# EAGLE design NE555TEST (EAGLE 9.6.2)
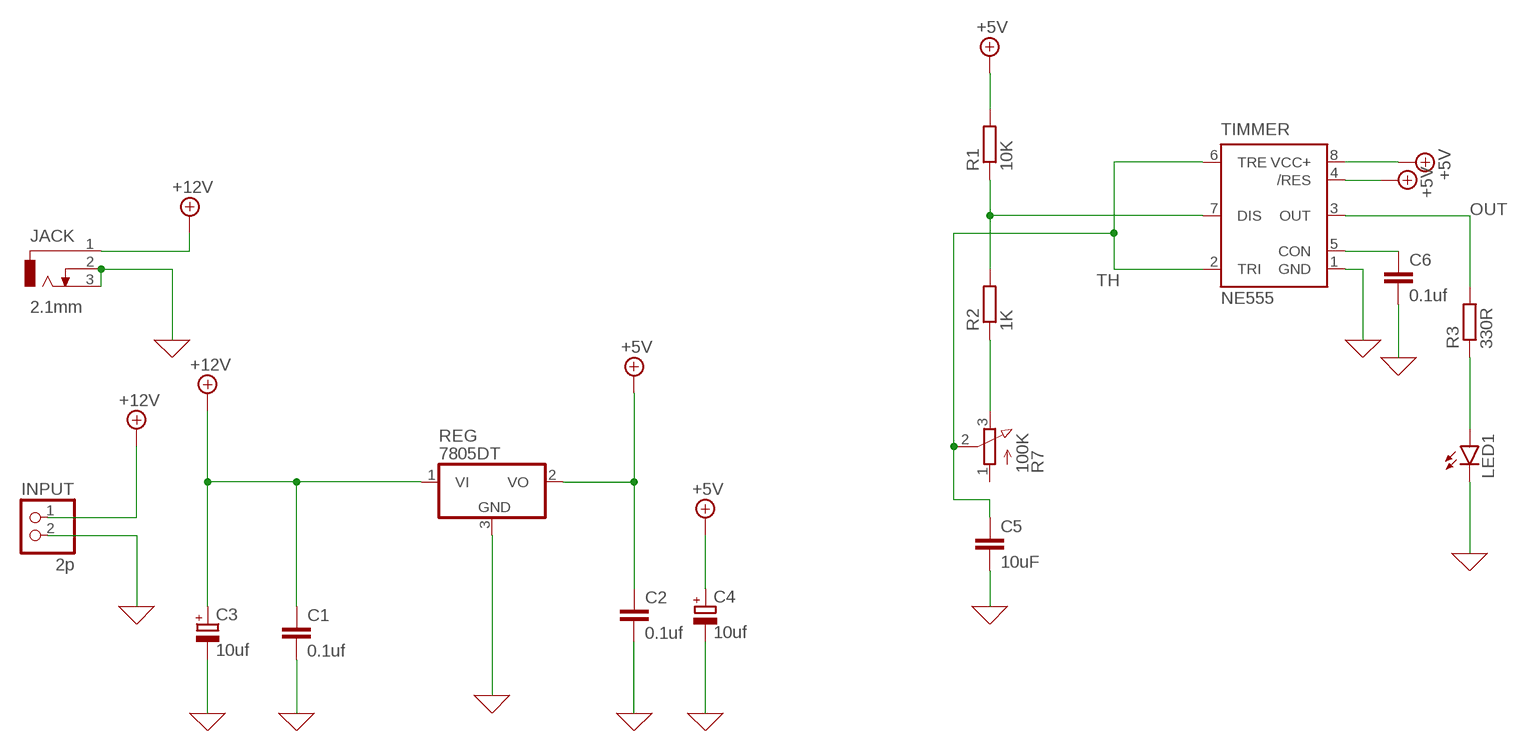
[diagram p0: schematic, sheet 1]

## Parts
C1  0.1uf  C-EU050-030X075  [C050-030X075]
C2  0.1uf  C-EU050-030X075  [C050-030X075]
C3  10uf  CPOL-EUE3.5-8  [E3,5-8]
C4  10uf  CPOL-EUE3.5-8  [E3,5-8]
C5  10uF  C-EU050-030X075  [C050-030X075]
C6  0.1uf  C-EU050-030X075  [C050-030X075]
INPUT  2p  PINHD-1X2  [1X02]
JACK  2.1mm  DCJ0202  [DCJ0202]
LED1  LED3MM  [LED3MM]
R1  10K  R-EU_0207/10  [0207/10]
R2  1K  R-EU_0207/10  [0207/10]
R3  330R  R-EU_0207/10  [0207/10]
R7  100K  3RP/1610N  [3RP/1610N]
REG  7805DT  [TO252]
TIMMER  NE555  [DIL-08]

## Nets
0 [power]: C1.2 C2.2 C3.- C4.- C5.2 C6.2 INPUT.2 JACK.2 JACK.3 LED1.K(C) REG.3(GND) TIMMER.1(GND) ; supply symbol labelled GND
+5V [power]: C2.1 C4.+ R1.2 REG.2(VO) TIMMER.4(/RES) TIMMER.8(VCC+)
+12V [power]: C1.1 C3.+ INPUT.1 JACK.1 REG.1(VI)
N$1: C6.1 TIMMER.5(CON)
N$2: R1.1 R2.2 TIMMER.7(DIS)
N$3: R2.1 R7.3(E)
N$6: LED1.A R3.1
OUT: R3.2 TIMMER.3(OUT)
TH: C5.1 R7.2(S) TIMMER.2(TRI) TIMMER.6(TRE)
Unconnected: R7.1(A)

## Library data of the parts
C1 C2 C5 C6 = rcl:C-EU: CAPACITOR, European symbol; SPICEPREFIX: C
C3 C4 = rcl:CPOL-EU: POLARIZED CAPACITOR, European symbol; SPICEPREFIX: C
INPUT = pinhead:PINHD-1X2: PIN HEADER
JACK = con-jack:DCJ0202: DC POWER JACK Source: DCJ0202.pdf; OC_FARNELL: unknown; OC_NEWARK: unknown
LED1 = led:LED: LED OSRAM: - CHIPLED LG R971, LG N971, LY N971, LG Q971, LY Q971, LO R971, LY R971 LH N974, LH R974 LS Q976, LO Q976, LY Q976 LO Q996 - Hyper CHIPLED LW Q18S LB Q993, LB Q99A, LB R99A - SideLED LS A670, LO A670, LY A670, LG A670, LP A670 LB A673, LV A673, LT A673, LW A673 LH A674 LY A675 LS A676, LA A676, LO A676, LY A676, LW A676 LS A679, LY A679, LG A679 - Hyper Micro SIDELED® LS Y876, LA Y876, LO Y876, LY Y876 LT Y87S - SmartLED LW L88C, LW L88S LB L89C, LB L89S, LG L890 LS L89K, LO L89K, LY L89K LS L896, LA L896, LO L896, LY L896 - TOPLED LS T670, LO T670, LY T670, LG T670, LP T670 LSG T670, LSP T670, LSY T670, LOP T670, LYG T670 LG T671, LOG T671, LSG T671 LB T673, LV T673, LT T673, LW T673 LH T674 LS T676, LA T676, LO T676, LY T676, LB T676, LH T676, LSB T676, LW T676 LB T67C, LV T67C, LT T67C, LS T67K, LO T67K, LY T67K, LW E67C LS E67B, LA E67B, LO E67B, LY E67B, LB E67C, LV E67C, LT E67C LW T67C LS T679, LY T679, LG T679 LS T770, LO T770, LY T770, LG T770, LP T770 LB T773, LV T773, LT T773, LW T773 LH T774 LS E675, LA E675, LY E675, LS T675 LS T776, LA T776, LO T776, LY T776, LB T776 LHGB T686 LT T68C, LB T68C - Hyper Mini TOPLED® LB M676 - Mini TOPLED Santana® LG M470 LS M47K, LO M47K, LY M47K Source: http://www.osram.convergy.de LUXEON: - LUMILED® LXK2-PW12-R00, LXK2-PW12-S00, LXK2-PW14-U00, LXK2-PW14-V00 LXK2-PM12-R00, LXK2-PM12-S00, LXK2-PM14-U00 LXK2-PE12-Q00, LXK2-PE12-R00, LXK2-PE12-S00, LXK2-PE14-T00, LXK2-PE14-U00 LXK2-PB12-K00, LXK2-PB12-L00, LXK2-PB12-M00, LXK2-PB14-N00, LXK2-PB14-P00, LXK2-PB14-Q00 LXK2-PR12-L00, LXK2-PR12-M00, LXK2-PR14-Q00, LXK2-PR14-R00 LXK2-PD12-Q00, LXK2-PD12-R00, LXK2-PD12-S00 LXK2-PH12-R00, LXK2-PH12-S00 LXK2-PL12-P00, LXK2-PL12-Q00, LXK2-PL12-R00 Source: www.luxeon.com KINGBRIGHT: KA-3528ASYC Source: www.kingbright.com
R1-R3 = rcl:R-EU_: RESISTOR, European symbol; SPICEPREFIX: R
R7 = pot:3RP/1610N: 16mm Potentiometer one level Source: http://www.alphapotentiometers.net/html/16mm_pot_2.html
REG = linear:78*: Positive VOLTAGE REGULATOR Source: http://cache.national.com/ds/LM/LM78L05.pdf http://www.fairchildsemi.com/ds/LM/LM7805.pdf
TIMMER = st-microelectronics:NE555: General purpose bipolar Timer; MF: Arrow Electronics; MPN: NE555N; OC_FARNELL: 1467742; OC_NEWARK: 89K1486

## Net classes
0 default: width 0.305 mm, drill 0.305 mm, clearance 0.254 mm
1 power: width 0.406 mm, drill 0.406 mm, clearance 0.305 mm

## Board
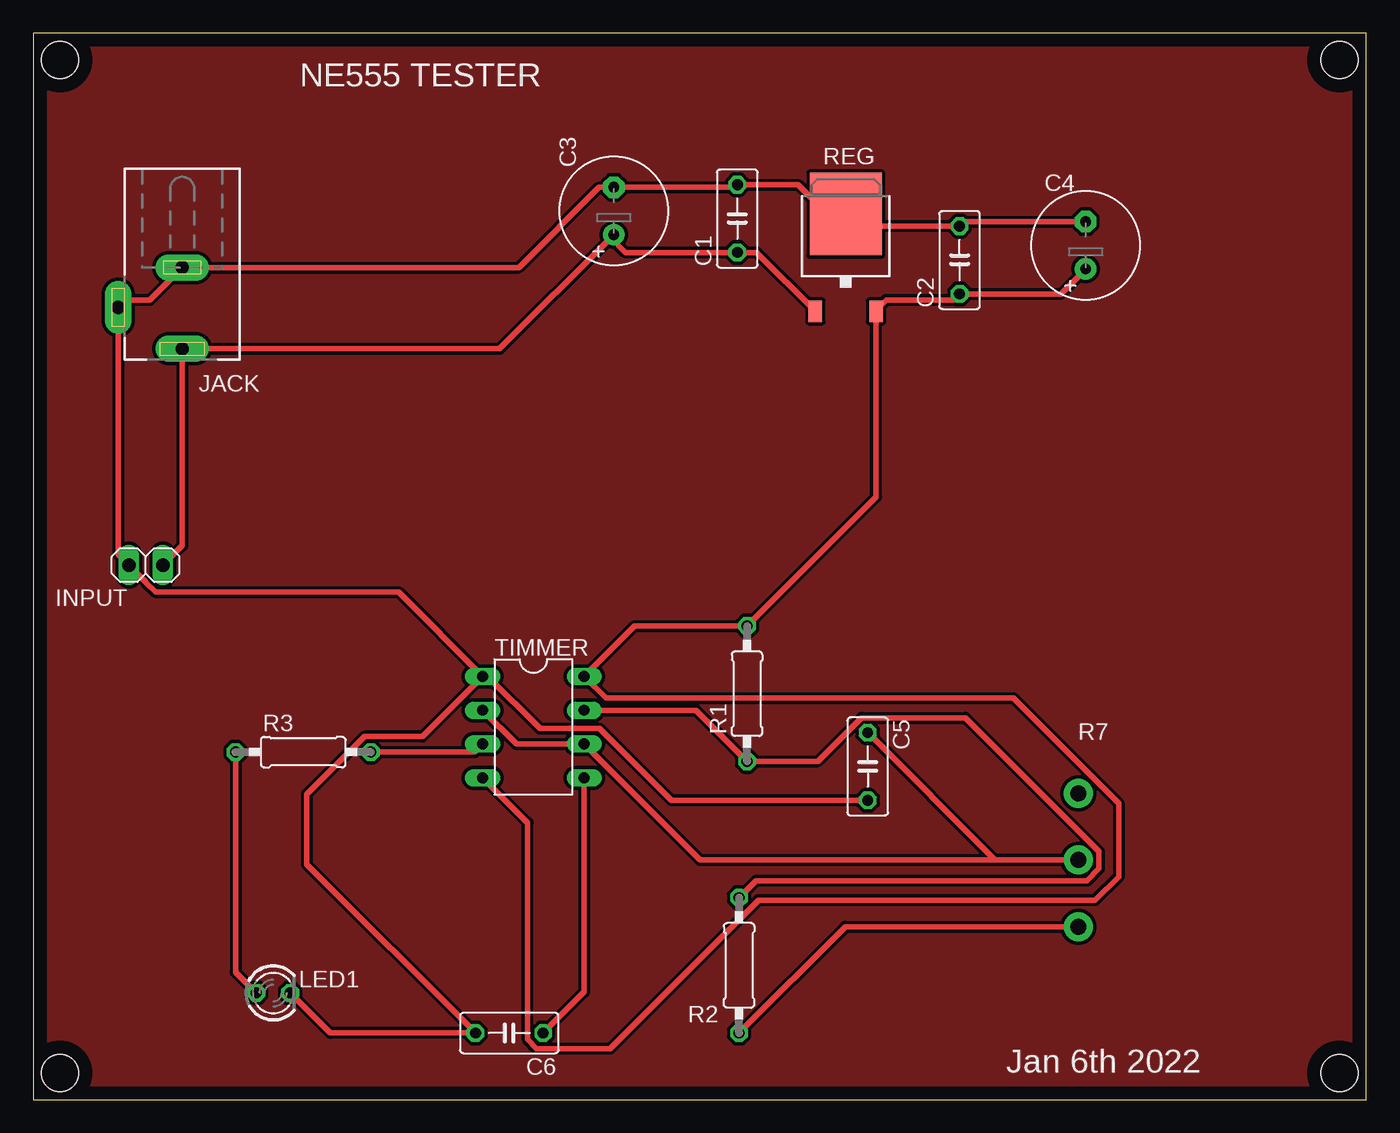
[diagram p1: board, top side]
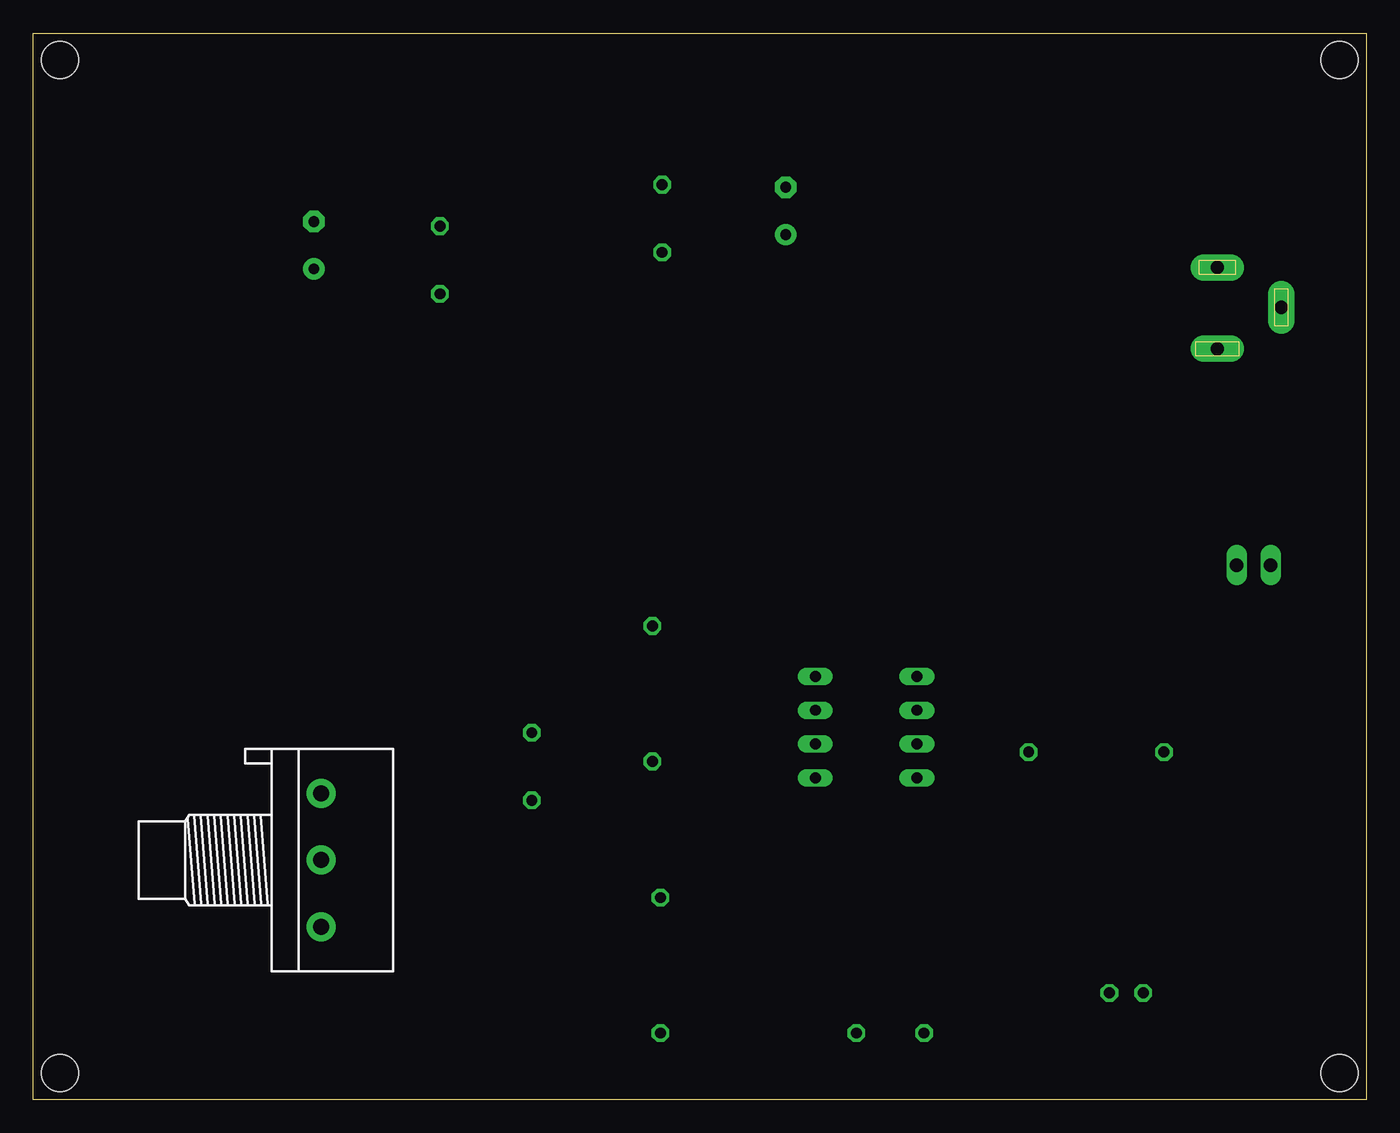
[diagram p2: board, bottom side, seen from below]

Size 100 x 80 mm. Coordinates in mm from the lower left corner, seen from the top.
Outline: 0,0 100,0 100,80 0,80 0,0
Copper layers (1*16): Top 0.035mm / dielectric 1.5mm / Bottom 0.035mm
Design rules "default": minimum track width 6mil, minimum drill 0.35mm, track to track 6mil, track to pad 6mil, pad to pad 6mil, via to via 6mil, smd to smd 6mil, copper to edge 40mil, drill to drill 6mil, minimum pad ring 10mil, minimum via ring 8mil, stop-mask expansion 4mil, vias tented up to drill 0mil, thermal gap 10mil
Holes 2.8 mm at 2,78 98,78 2,2 98,2

### Footprints (pad centres in the part's own frame; a part is rotated, then mirrored left to right if it is on the bottom)
C050-030X075 = drill 0.813 octagon: 1 -2.54,0; 2 2.54,0
E3,5-8 = drill 0.813 pad 1.6: + -1.778,0 | drill 0.813 pad 1.6 octagon: - 1.778,0
1X02 = drill 1.016 long: 1 -1.27,0; 2 1.27,0
DCJ0202 = drill 1 pad 2 long: 1 0,3.1; 2 4.8,0; 3 0,-3
LED3MM = drill 0.813 octagon: A -1.27,0; K 1.27,0
0207/10 = drill 0.813 octagon: 1 -5.08,0; 2 5.08,0
3RP/1610N = drill 1.2 pad 2.184: 1 -5,0; 2 0,0; 3 5,0
TO252 = smd 1 x 1.6: 1 -2.28,-4.8; 2 2.28,-4.8 | smd 5.4 x 6.2: 3 0,2.5
DIL-08 = drill 0.813 long: 1 -3.81,-3.81; 2 -1.27,-3.81; 3 1.27,-3.81; 4 3.81,-3.81; 5 3.81,3.81; 6 1.27,3.81; 7 -1.27,3.81; 8 -3.81,3.81

### Placement (x,y rotation side)
C1  52.82,66.1 90 top
C2  69.49,62.99 90 top
C3  43.55,66.67 90 top
C4  78.95,64.1 90 top
C5  62.6,24.99 270 top
C6  35.71,4.99 180 top
INPUT  8.44,40.1 180 top
JACK  11.17,59.43 180 top
LED1  18,8 0 top
R1  53.55,30.45 90 top
R2  52.95,10.07 90 top
R3  20.25,26.07 0 top
R7  78.41,17.97 270 bottom
REG  60.95,63.94 0 top
TIMMER  37.52,27.94 270 top

### Tracks (layer width: path | path; a pad name or v marks a point on that pad's centre or on a via)
0
  Top 0.406: 61,66.49 61,67 60,66 57.36,68.64 C1.2 52.63,68.45 C3.- 42.45,68.45 36.43,62.43 JACK.3 8.74,60 6,60 6,59.8 JACK.2 6.37,40.9 INPUT.2 8.44,38.83 8.44,38.81 9.18,38.07 27.39,38.07 TIMMER.1 | 61,66.49 REG.3 | 61,66.49 61.51,66.49 62.47,65.53 C2.2 69.84,65.88 C4.- | TIMMER.1 29.2,27.24 24.85,27.24 20.51,22.9 20.51,17.65 C6.2 22.28,4.99 LED1.K | C5.2 47.86,22.45 42.47,27.84 38,27.84 34.09,31.75 TIMMER.1
+5V
  Top 0.406: C4.+ 77.08,60.45 C2.1 69.04,60 64,60 63.23,59.23 REG.2 63.23,45.21 R1.2 45.11,35.53 TIMMER.8 42.96,30.12 73.52,30.12 81.43,22.21 81.43,16.72 79.66,14.95 54.4,14.95 43.27,3.82 37.77,3.82 37.08,4.51 37.08,20.76 TIMMER.4
+12V
  Top 0.406: 43.33,64.67 34.99,56.33 JACK.1 11.17,41.56 INPUT.1 | 43.33,64.67 C3.+ | REG.1 54.25,63.56 C1.1 44.44,63.56 43.33,64.67
GND
  pour Top: 0,78 2,80 98,80 100,78 100,2 98,0 0,0
N$1
  Top 0.406: TIMMER.5 41.33,8.07 C6.1
N$2
  Top 0.406: TIMMER.7 49.71,29.21 R1.1 58.86,25.37 62.14,28.65 69.92,28.65 79.96,18.61 79.96,17.33 79.05,16.42 54.22,16.42 R2.2
N$3
  Top 0.406: R2.1 60.93,12.97 R7.3
N$6
  Top 0.406: LED1.A 15.17,9.56 R3.1
OUT
  Top 0.406: R3.2 33.11,26.07 TIMMER.3
TH
  Top 0.406: TIMMER.2 36.25,26.67 TIMMER.6 50.03,17.97 R7.2 72.16,17.97 C5.1

### Text on the board
tNames: NE555 TESTER | Jan 6th 2022